# Altium schematic sheet Main.SchDoc
size B; SheetNumber: 1; SheetTotal: 8
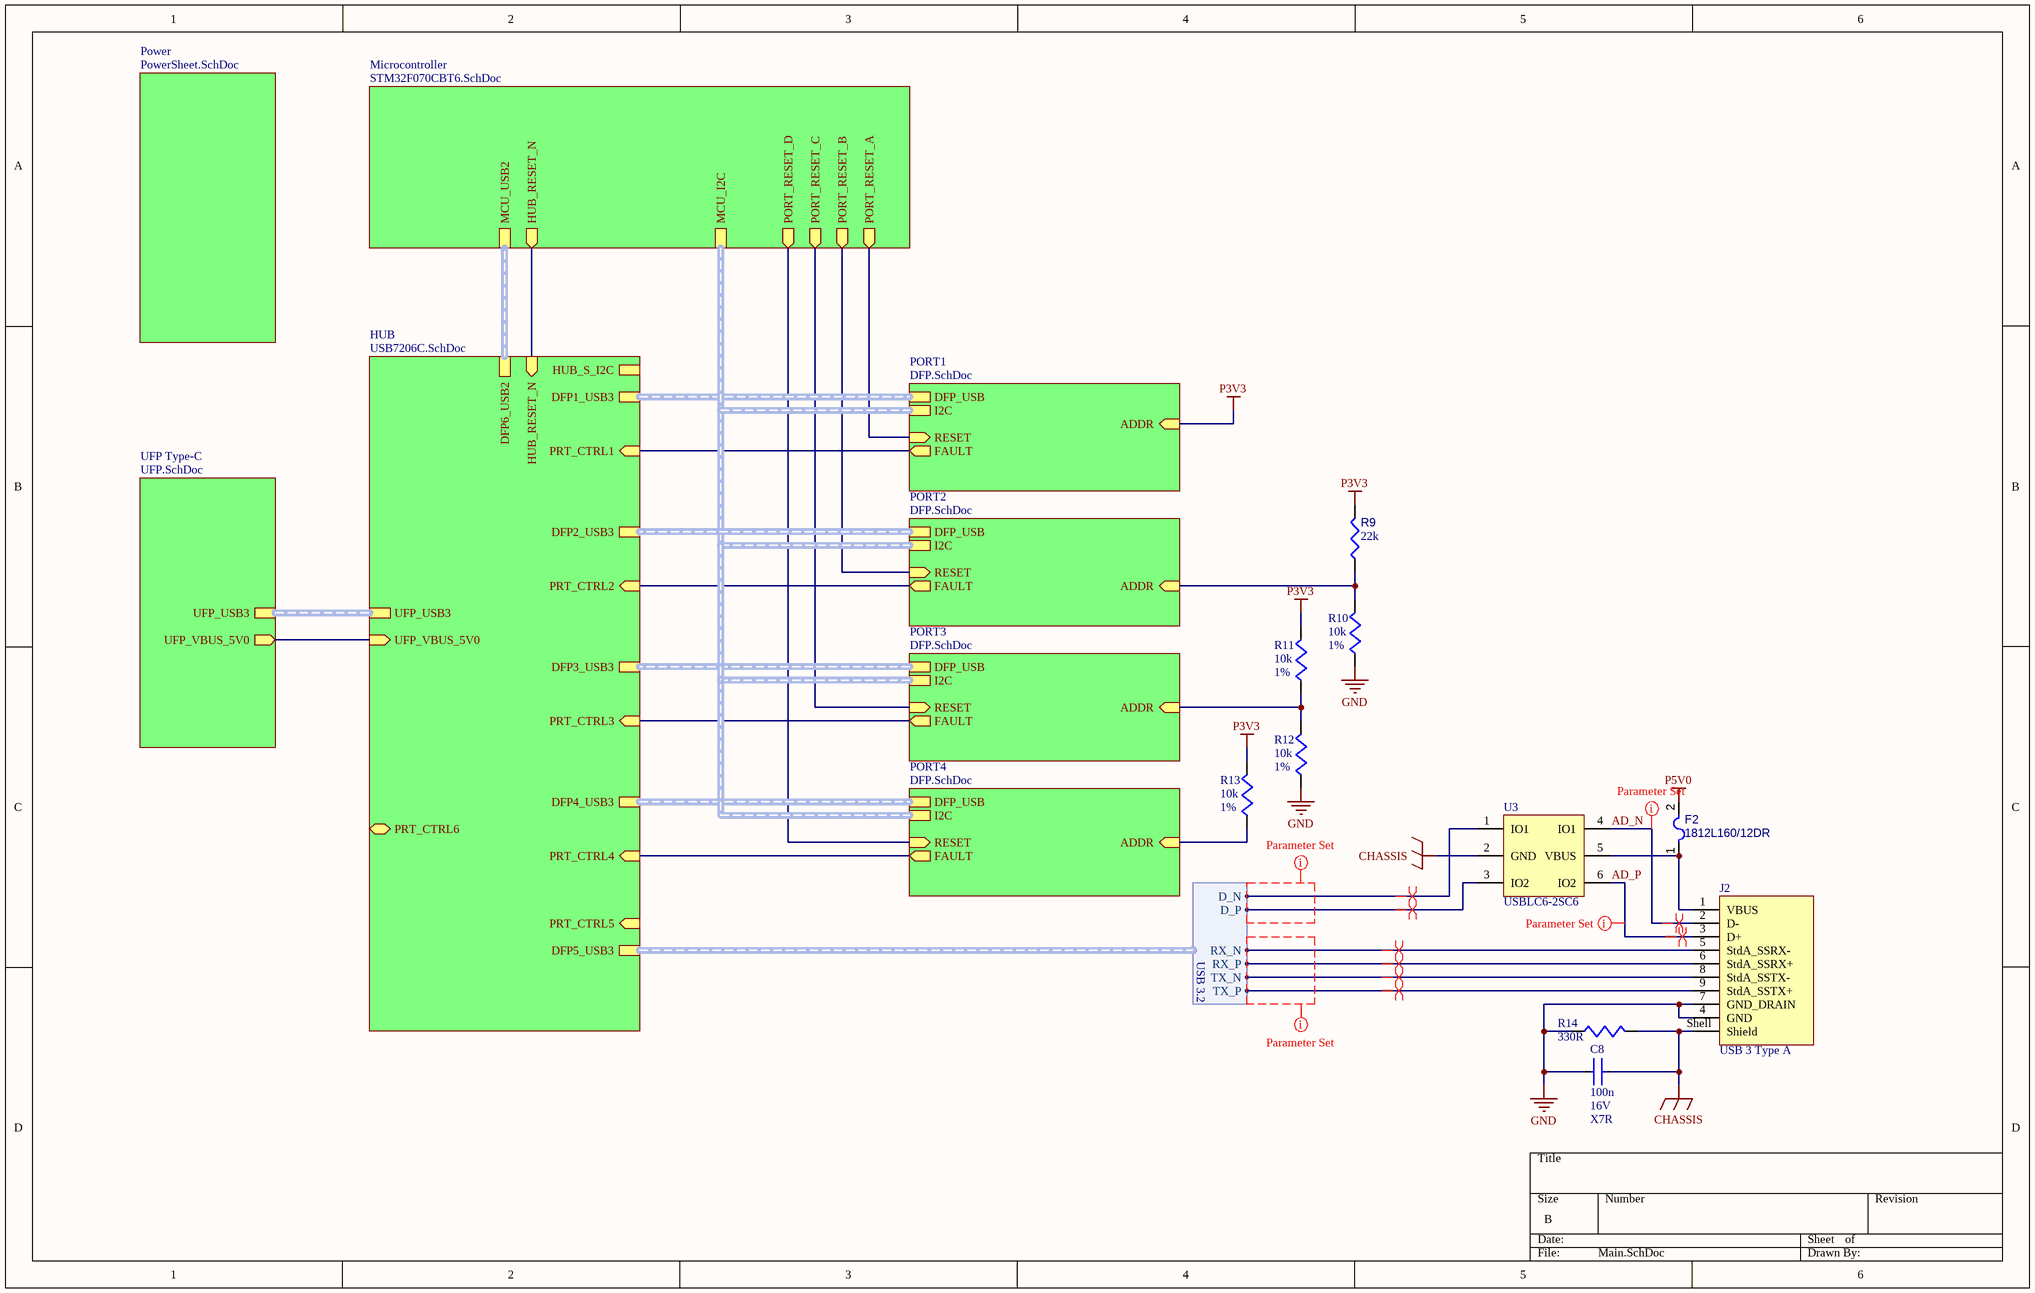
[diagram p0: Main.SchDoc]

## Parts
C8  value 100n  Voltage: 16V  Dielectric: X7R  [CAPC1005X06N]  (hidden comment: 100nF 16V 0402)
F2  1812L160/12DR  [LFUS-1812L16012_V]
J2  USB 3 Type A  [692121030100]
R9  value 22k  [RESC0402(1005)_L]  (hidden comment: 22KR2F)
R10  value 10k  Tolerance: 1%  [RESC1005X04M]  (hidden comment: 10k 1% 0402)
R11  value 10k  Tolerance: 1%  [RESC1005X04M]  (hidden comment: 10k 1% 0402)
R12  value 10k  Tolerance: 1%  [RESC1005X04M]  (hidden comment: 10k 1% 0402)
R13  value 10k  Tolerance: 1%  [RESC1005X04M]  (hidden comment: 10k 1% 0402)
R14  value 330R  [RESC1005X04M]  (hidden comment: 330R 1% 0402)
U3  USBLC6-2SC6  [SOT95P280X145-6N]

## Sub-sheets
HUB = USB7206C.SchDoc: UFP_USB3 (harness USB 3.2), DFP1_USB3 (harness USB 3.2), DFP2_USB3 (harness USB 3.2), DFP3_USB3 (harness USB 3.2), DFP4_USB3 (harness USB 3.2), DFP6_USB2 (harness USB 2.0), UFP_VBUS_5V0 (in), DFP5_USB3 (harness USB 3.2), PRT_CTRL4 (in), PRT_CTRL3 (in), PRT_CTRL2 (in), PRT_CTRL1 (in), PRT_CTRL6 (bidir), HUB_S_I2C (harness S_I2C), HUB_RESET_N (in), PRT_CTRL5 (in)
Microcontroller = STM32F070CBT6.SchDoc: MCU_USB2 (harness USB 2.0), MCU_I2C, PORT_RESET_A (out), PORT_RESET_B (out), PORT_RESET_C (out), PORT_RESET_D (out), HUB_RESET_N (out)
PORT1 = DFP.SchDoc: DFP_USB (harness USB 3.2), I2C (harness I2C), ADDR (in), RESET (in), FAULT (out)
PORT2 = DFP.SchDoc: DFP_USB (harness USB 3.2), I2C (harness I2C), ADDR (in), RESET (in), FAULT (out)
PORT3 = DFP.SchDoc: DFP_USB (harness USB 3.2), I2C (harness I2C), ADDR (in), RESET (in), FAULT (out)
PORT4 = DFP.SchDoc: DFP_USB (harness USB 3.2), I2C (harness I2C), ADDR (in), RESET (in), FAULT (out)
Power = PowerSheet.SchDoc: no entries
UFP Type-C = UFP.SchDoc: UFP_USB3 (harness USB 3.2), UFP_VBUS_5V0 (out)

## Harnesses
USB 3.2: D_P, D_N, TX_P, TX_N, RX_P, RX_N

## Nets
CHASSIS: C8.1 J2.Shell(Shield) R14.2 U3.2(GND)
GND: C8.2 J2.4(GND) J2.7(GND_DRAIN) R10.1 R12.1 R14.1
P3V3: R9.2 R11.2 R13.2 ; sheet PORT1/ADDR
P5V0: F2.2
AD_N: J2.2(D-) U3.4(IO1)
AD_P: J2.3(D+) U3.6(IO2)
NetF2_1: F2.1 J2.1(VBUS) U3.5(VBUS)
NetJ2_5: J2.5(StdA_SSRX-) ; sheet HUB/DFP5_USB3.RX_N
NetJ2_6: J2.6(StdA_SSRX+) ; sheet HUB/DFP5_USB3.RX_P
NetJ2_8: J2.8(StdA_SSTX-) ; sheet HUB/DFP5_USB3.TX_N
NetJ2_9: J2.9(StdA_SSTX+) ; sheet HUB/DFP5_USB3.TX_P
NetR9_1: R9.1 R10.2 ; sheet PORT2/ADDR
NetR11_1: R11.1 R12.2 ; sheet PORT3/ADDR
NetR13_1: R13.1 ; sheet PORT4/ADDR
NetU3_1: U3.1(IO1) ; sheet HUB/DFP5_USB3.D_N
NetU3_3: U3.3(IO2) ; sheet HUB/DFP5_USB3.D_P
(unnamed): sheet PORT1/RESET, sheet Microcontroller/PORT_RESET_A
(unnamed): sheet PORT1/FAULT, sheet HUB/PRT_CTRL1
(unnamed): sheet PORT2/RESET, sheet Microcontroller/PORT_RESET_B
(unnamed): sheet PORT2/FAULT, sheet HUB/PRT_CTRL2
(unnamed): sheet PORT3/RESET, sheet Microcontroller/PORT_RESET_C
(unnamed): sheet PORT3/FAULT, sheet HUB/PRT_CTRL3
(unnamed): sheet PORT4/RESET, sheet Microcontroller/PORT_RESET_D
(unnamed): sheet PORT4/FAULT, sheet HUB/PRT_CTRL4
(unnamed): sheet UFP Type-C/UFP_VBUS_5V0, sheet HUB/UFP_VBUS_5V0
(unnamed): sheet Microcontroller/HUB_RESET_N, sheet HUB/HUB_RESET_N

## Buses and harness runs
harness sheet HUB/DFP1_USB3 = sheet PORT1/DFP_USB
harness sheet HUB/DFP2_USB3 = sheet PORT2/DFP_USB
harness sheet HUB/DFP3_USB3 = sheet PORT3/DFP_USB
harness sheet HUB/DFP4_USB3 = sheet PORT4/DFP_USB
harness sheet HUB/DFP6_USB2 = sheet Microcontroller/MCU_USB2
harness sheet HUB/UFP_USB3 = sheet UFP Type-C/UFP_USB3
harness sheet Microcontroller/MCU_I2C = sheet PORT1/I2C = sheet PORT2/I2C = sheet PORT3/I2C = sheet PORT4/I2C

## Layout directives
net class USB2: (no net found under the mark), AD_N, AD_P
net class USB3: (no net found under the mark)
differential pair: AD_N, AD_P, NetJ2_5, NetJ2_6, NetJ2_8, NetJ2_9, NetU3_1, NetU3_3

## Library data of the parts
C8 = CMP-001-00088-2: 16V 100nF X7R ±10% 0402 Multilayer Ceramic Capacitors MLCC - SMD/SMT ROHS; LCSC Part #: C1525; Package: 0402
F2 = CMP-005-00006-3: POLY-FUSE(R) Resettable PTC, 12 V, 1.6 A, -40 to 85 degC, 2-Pin SMD, RoHS, Tape and Reel; Manufacturer: Littelfuse; Resistance: 100mohm; Current Rating: 100A; Nominal Supply Voltage: 12V; Max Operating Temperature: 85°C; Case/Package: 1812; Package Quantity: 1500; Datasheet URL: http://www.littelfuse.com/~/media/electronics/datasheets/resettable_ptcs/littelfuse_ptc_1812l_datasheet.pdf.pdf; Package Description: 2-Pin Surface Mount Device, Body 4.55 x 3.24 mm; Package Reference: 1812; Packaging: TapeandReel; Datasheet Version: Feb-16; Min Operating Temperature: -40°C; Mounting Technology: SM; RoHS Compliant: True
J2 = CMP-002-00126-1: USB Connector, 9 Contact(s), Female, Right Angle, Solder Terminal, Locking, Plug; Connector Type: TELECOM AND DATACOM CONNECTOR; Mounting Technology: Board; Max Operating Temperature: 85°C; Min Operating Temperature: -20°C; RoHS Compliant: Yes
R9 = CMP-009-00081-3: 22K 0.063W 1% 0402 (1005 Metric)  SMD; Power: 63mW; Mounting Technology: SMT; Tolerance: 1%; Case/Package: 0402; Pins: 2
R10-R13 = CMP-009-00187-1: 62.5mW Thick Film Resistors 50V ±100ppm/℃ ±1% 10kΩ 0402 Chip Resistor - Surface Mount ROHS; LCSC Part #: C60490; Package: 0402
R14 = CMP-009-00201-3: 62.5mW Thick Film Resistors 50V ±100ppm/℃ ±1% 330Ω 0402 Chip Resistor - Surface Mount ROHS; Tolerance: 1%; LCSC Part #: C105875; Package: 0402
U3 = CMP-015-00019-1: Trans Voltage Suppressor Diode, 5V V(RWM), Unidirectional, 1 Element, Silicon; LCSC Part #: C7519